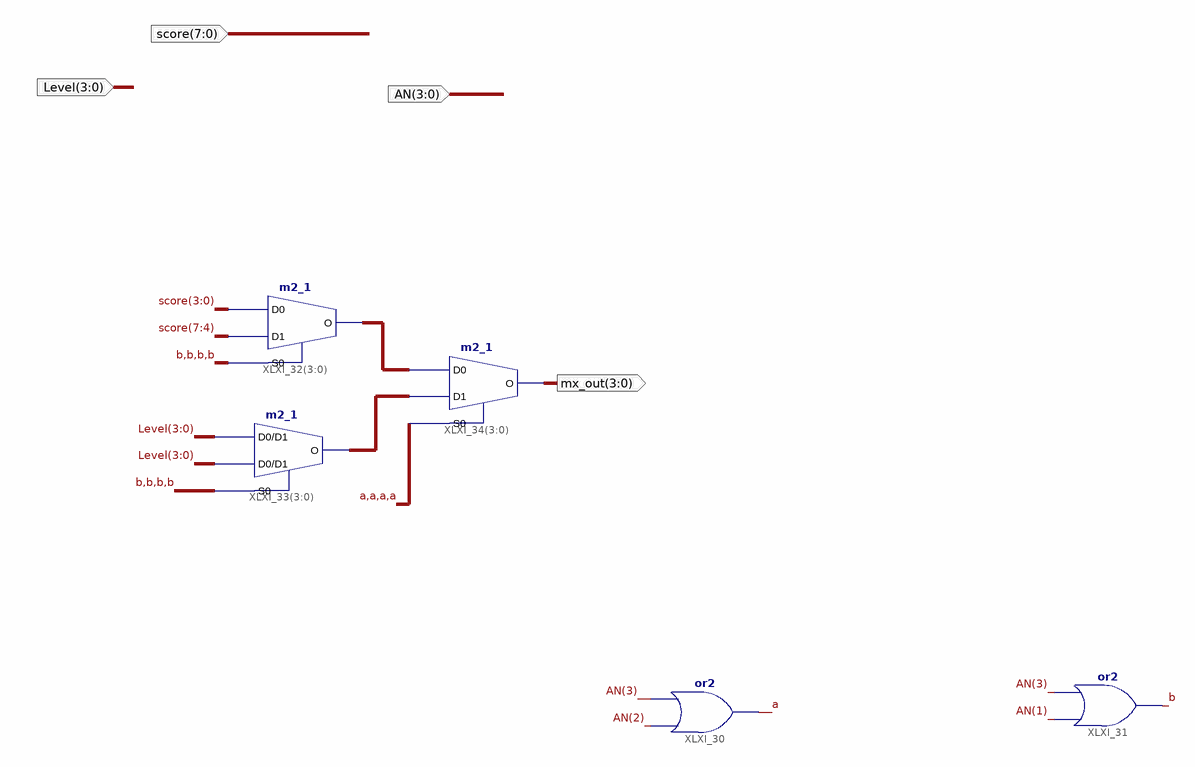
[diagram p0: schematic sheet 1]
// Xilinx ISE schematic NEW_SELECT4.sch (spartan3e) as structural Verilog: 5 symbols, 4 ports
module NEW_SELECT4 (
  input  [7:0] score,
  input  [3:0] Level,
  input  [3:0] AN,
  output [3:0] mx_out
);

  wire a, b;
  wire [3:0] XLXN_70, XLXN_71;

  or XLXI_30 (a, AN[2], AN[3]);
  or XLXI_31 (b, AN[1], AN[3]);
  m2_1 XLXI_32[3:0] (.D0(score[3:0]), .D1(score[7:4]), .S0({4{b}}), .O(XLXN_70));
  m2_1 XLXI_33[3:0] (.D0(Level), .D1(Level), .S0({4{b}}), .O(XLXN_71));
  m2_1 XLXI_34[3:0] (.D0(XLXN_70), .D1(XLXN_71), .S0({4{a}}), .O(mx_out));
endmodule
